# Altium project lab_1_pankov_usb_rs232.PrjPcb
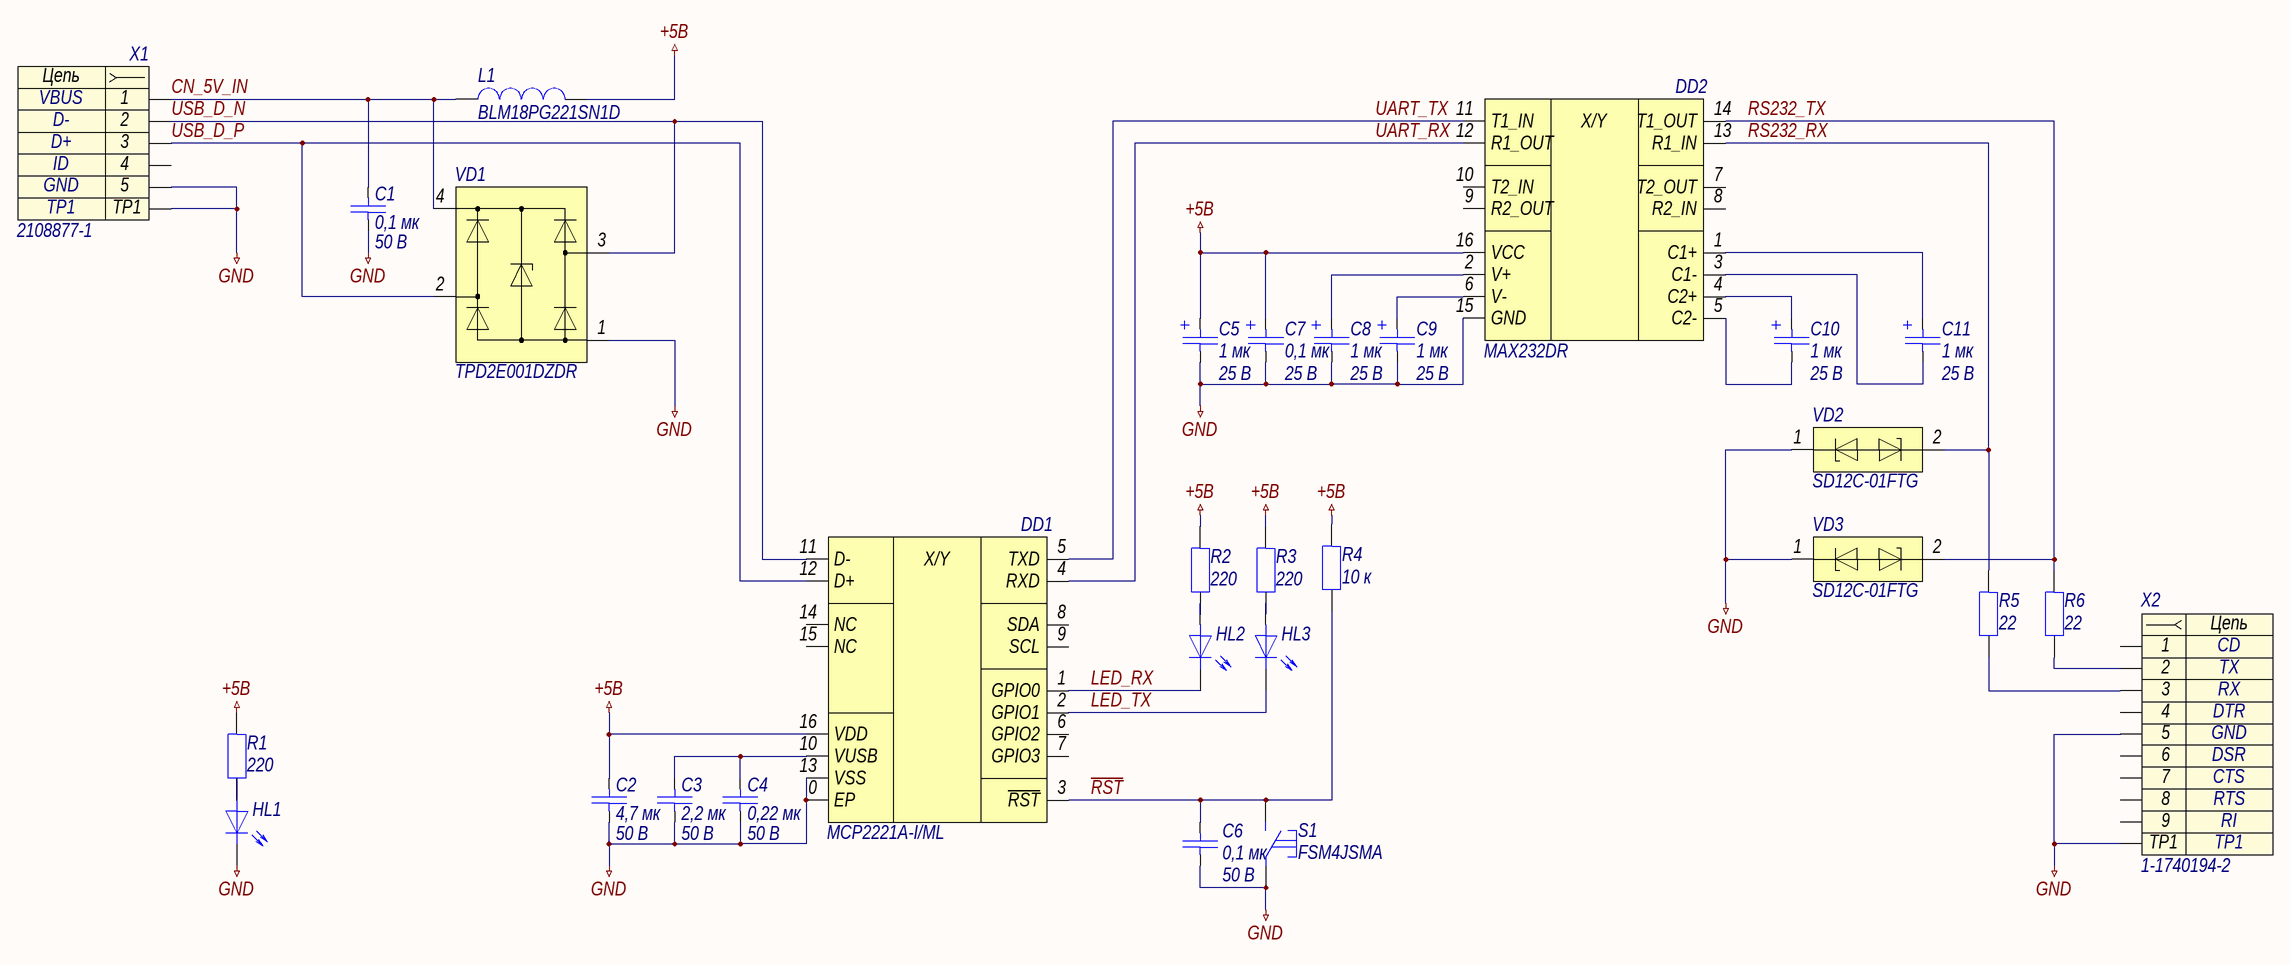
[diagram p0: lab_1_pankov_usb_rs232.SchDoc]
title_line_2: USB-RS232; title_line_1: Преобразователь; title: Лабораторная работа №1 — Преобразователь интерфейсов; sheets_total: 2; project: Преобразователь USB-RS232; pcb_dec_number: СПБПУ.3331506.019; document_type: Схема электрическая принципиальная; document_code: Ý3; developer: Паньков; designation: СПБПУ.3331506.019; check: Капустин
2 sheets, 29 parts. Net scope: global (net labels, ports and power ports of the same name join across sheets).
Board file: lab_1_pankov_usb_rs232.PcbDoc
Sheets:
  lab_1_pankov_usb_rs232.SchDoc
  usb_rs232_preferences.SchDoc

## Sheet lab_1_pankov_usb_rs232.SchDoc: Лабораторная работа №1 — Преобразователь интерфейсов
size 594 x 420 mm; CheckedBy: Капустин; DrawnBy: Паньков; DocumentNumber: СПБПУ.3331506.019Ý3; SheetNumber: 1; SheetTotal: 2; DocumentCode: Ý3; ImagePath: СПБПУ.3331506.019

### Parts
C1  0,1 мк  Напряжение: 50 В  [C0603]
C2  4,7 мк  Напряжение: 50 В  [C0603]
C3  2,2 мк  Напряжение: 50 В  [C0603]
C4  0,22 мк  Напряжение: 50 В  [C0603]
C5  1 мк  Напряжение: 25 В  [C1206POLAR]
C6  0,1 мк  Напряжение: 50 В  [C0603]
C7  0,1 мк  Напряжение: 25 В  [C1206POLAR]
C8  1 мк  Напряжение: 25 В  [C1206POLAR]
C9  1 мк  Напряжение: 25 В  [C1206POLAR]
C10  1 мк  Напряжение: 25 В  [C1206POLAR]
C11  1 мк  Напряжение: 25 В  [C1206POLAR]
DD1  MCP2221A-I/ML  [QFN-16-4X4]
DD2  MAX232DR  [SOIC-16]
HL1  TLMS1000-GS08  [HL0603]  (value not drawn)
HL2  TLMS1000-GS08  [HL0603]  (value not drawn)
HL3  TLMS1000-GS08  [HL0603]  (value not drawn)
L1  BLM18PG221SN1D  [BLM-2-0603]
R1  220  [R0603]
R2  220  [R0603]
R3  220  [R0603]
R4  10 к  [R0603]
R5  22  [R0603]
R6  22  [R0603]
S1  FSM4JSMA  [FSM4JSMA]
VD1  TPD2E001DZDR  [SOT143-4]
VD2  SD12C-01FTG  [SOD323]
VD3  SD12C-01FTG  [SOD323]
X1  2108877-1  [2108877-1]
X2  1-1740194-2  [1-1740194-2]

### Nets
+5В: C2.1 C5.1 C7.1 DD1.16(VDD) DD2.16(VCC) L1.2 R1.1 R2.1 R3.1 R4.1
GND: C1.2 C2.2 C3.2 C4.2 C5.2 C6.2 C7.2 C8.2 C9.2 DD1.0(EP) DD1.13(VSS) DD2.15(GND) HL1.1 S1.1 VD1.1(VCC) VD2.1 VD3.1 X1.5 X1.TP1 X2.5 X2.TP1
CN_5V_IN: C1.1 L1.1 VD1.4(GND) X1.1
LED_RX: DD1.1(GPIO0) HL2.1
LED_TX: DD1.2(GPIO1) HL3.1
~{RST}: C6.1 DD1.3(~{RST}) R4.2 S1.2
RS232_RX: DD2.13(R1_IN) R5.1 VD2.2
RS232_TX: DD2.14(T1_OUT) R6.1 VD3.2
UART_RX: DD1.4(RXD) DD2.12(R1_OUT)
UART_TX: DD1.5(TXD) DD2.11(T1_IN)
USB_D_N: DD1.11(D-) VD1.3(IO1) X1.2
USB_D_P: DD1.12(D+) VD1.2(NC) X1.3
NetC3_1: C3.1 C4.1 DD1.10(VUSB)
NetC8_1: C8.1 DD2.2(V+)
NetC9_1: C9.1 DD2.6(V-)
NetC10_1: C10.1 DD2.4(C2+)
NetC10_2: C10.2 DD2.5(C2-)
NetC11_1: C11.1 DD2.1(C1+)
NetC11_2: C11.2 DD2.3(C1-)
NetHL1_2: HL1.2 R1.2
NetHL2_2: HL2.2 R2.2
NetHL3_2: HL3.2 R3.2
NetR5_2: R5.2 X2.3
NetR6_2: R6.2 X2.2

Not connected (* = marked no-connect by the designer): DD1 6(GPIO2) 7(GPIO3) 8(SDA) 9(SCL) 14(NC) 15(NC); DD2 7(T2_OUT) 8(R2_IN) 9(R2_OUT) 10(T2_IN); X1 4; X2 1 4 6 7 8 9

### Notes on the sheet
- Перв. примен.
- Справ. №
- Подп. и дата
- Инв. № дубл.
- Нормоконтроль:
- Взам. инв. №
- Изм.
- Лист
- № докум.
- Подп.
- Дата
- Лит.
- Масса
- Масштаб
- Т.контр.
- Пров.
- Разраб.
- Листов
- Разработал:
- Инв. № подл.
- Н.контр.
- Утв.
- Копировал
- Формат
- А2
- (in symbol dd0005) X/Y
- (in symbol dd0007) X/Y
- (in symbol x0001) Цепь
- (in symbol x0002) Цепь

### Library data of the parts
C1 C6 = c0018: =Описание; ID: c0018; Фамилия: Ларионов; Описание: Конденсатор чип 0603 0,1 мкФ 50 В ±5 %; Наименование: CC0603JRX7R9BB104; Производитель: YAGEO Corp.; Отклонение: ±5 %; Рабочие температуры: от -55 °С до +125 °С; Корпус: 0603; Номинал: 0,1 мк; Номинальное напряжение: 50 В; HelpURL: https://www.yageo.com/upload/media/product/products/datasheet/mlcc/UPY-GPHC_X7R_6.3V-to-50V_20.pdf
C2 = c0029: =Описание; ID: c0029; Фамилия: Ларионов; Описание: Конденсатор чип 0603 4,7 мкФ 25 В ±10 %; Наименование: CC0603KRX5R8BB475; Производитель: YAGEO Corp.; Отклонение: ±10 %; Номинальное напряжение: 25 В; Рабочие температуры: от -55 °С до +85 °С; Корпус: 0603; Номинал: 4,7 мк; HelpURL: https://www.yageo.com/upload/media/product/productsearch/datasheet/mlcc/UPY-GPHC_X5R_4V-to-50V_26.pdf
C3 = c0026: =Описание; ID: c0026; Фамилия: Самарин; Описание: Конденсатор чип 0603 2,2 мкФ 50 В ±10 %; Наименование: CC0603KRX5R9BB225; Производитель: YAGEO Corp.; Отклонение: ±10 %; Рабочие температуры: от -55 °С до +85 °С; Корпус: 0603; Номинал: 2,2 мк; Номинальное напряжение: 50 В; HelpURL: https://www.yageo.com/upload/media/product/productsearch/datasheet/mlcc/UPY-GPHC_X5R_4V-to-50V_26.pdf
C4 = c0021: =Описание; ID: c0021; Фамилия: Самарин; Описание: Конденсатор чип 0603 0,22 мкФ 50 В ±5 %; Наименование: CC0603JRX7R9BB224; Производитель: YAGEO Corp.; Отклонение: ±5 %; Рабочие температуры: от -55 °С до +125 °С; Корпус: 0603; Номинал: 0,22 мк; Номинальное напряжение: 50 В; HelpURL: https://www.yageo.com/upload/media/product/products/datasheet/mlcc/UPY-GPHC_X7R_6.3V-to-50V_20.pdf
C5 C8-C11 = c0040: =Описание; ID: c0040; Фамилия: Ларионов; Описание: Конденсатор чип 1206 1 мкФ 25 В ±10 % полярный; Наименование: 293D105X9025A2TE3; Производитель: Vishay Intertechnology, Inc.; Отклонение: ±10 %; Рабочие температуры: от -55 °С до +125 °С; Корпус: 1206; Номинал: 1 мк; Номинальное напряжение: 25 В; HelpURL: https://www.vishay.com/capacitors/list/product-40002/
C7 = c0039: =Описание; ID: c0039; Фамилия: Ларионов; Описание: Конденсатор чип 1206 0,1 мкФ 50 В ±10 % полярный; Наименование: 293D104X9050A2TE3; Производитель: Vishay Intertechnology, Inc.; Отклонение: ±10 %; Номинальное напряжение: 50 В; Рабочие температуры: от -55 °С до +125 °С; Корпус: 1206; Номинал: 0,1 мк; HelpURL: https://www.vishay.com/capacitors/list/product-40002/
DD1 = dd0005: =Описание; ID: dd0005; Фамилия: Паньков; Описание: Преобразователь USB-I2C/UART; Производитель: Microchip Technology Inc.; Корпус: QFN-16 (4 x 4); Наименование: MCP2221A-I/ML; HelpURL: https://www.microchip.com/wwwproducts/en/MCP2221A
DD2 = dd0007: =Описание; ID: dd0007; Фамилия: Паньков; Описание: Приемопередатчик RS-232; Производитель: Texas Instruments; Наименование: MAX232DR; Корпус: SOIC-16; HelpURL: https://www.ti.com/product/MAX232?dcmp=dsproject&hqs=pf
HL1-HL3 = hl0001: =Описание; ID: hl0001; Фамилия: Ларионов; Описание: Светодиод чип 0603 красный; Производитель: Vishay Intertechnology, Inc.; Цвет: Red; Номинальная сила света: 4 мкд; Номинальная длина волны: 628 нм; Номинальный прямой ток: 15 мА; Номинальное падение напряжения: 1,8 В; Рассеиваемая мощность: 40 мВт; Рабочие температуры: от -40 °С до +100 °С; Корпус: 0603; Наименование: TLMS1000-GS08; HelpURL: https://www.vishay.com/leds/list/product-83172/
L1 = l0002: =Описание; ID: l0002; Фамилия: Самарин; Описание: Ферритовая бусина 220 Ом ±25 %; Производитель: Murata Manufacturing Co., Ltd.; Сопротивление, 100 МГц: 220 Ом; Отклонение, 100 Мгц: ±25 %; Сопротивление при постоянном токе: 0,1 Ом; Рабочие температуры: от -55 °С до +125 °С; Корпус: 0603; Наименование: BLM18PG221SN1D; HelpURL: https://www.murata.com/en-global/products/productdetail?partno=BLM18PG221SN1%23
R1-R3 = r0007: =Описание; ID: r0007; Фамилия: Ларионов; Описание: Резистор чип 0603 220 Ом ±1 % 0,1 Вт; Наименование: RC0603FR-07220RL; Производитель: Yageo; Отклонение: ±1 %; Номинальное напряжение: 75 В; Рабочие температуры: от -55 °С до +155 °С; Номинальный ток: 1 А; Корпус: 0603; Номинал: 220; HelpURL: https://www.yageo.com/upload/media/product/productsearch/datasheet/rchip/PYu-RC_Group_51_RoHS_L_11.pdf
R4 = r0012: =Описание; ID: r0012; Фамилия: Самарин; Описание: Резистор чип 0603 10 кОм ±1 % 0,1 Вт; Наименование: RC0603FR-0710KL; Производитель: Yageo; Отклонение: ±1 %; Номинальное напряжение: 75 В; Рабочие температуры: от -55 °С до +155 °С; Номинальный ток: 1 А; Корпус: 0603; Номинал: 10 к; HelpURL: https://www.yageo.com/upload/media/product/productsearch/datasheet/rchip/PYu-RC_Group_51_RoHS_L_11.pdf
R5 R6 = r0003: =Описание; ID: r0003; Фамилия: Ларионов; Описание: Резистор чип 0603 22 Ом ±1 % 0,1 Вт; Наименование: RC0603FR-0722RL; Производитель: Yageo; Отклонение: ±1 %; Номинальное напряжение: 75 В; Рабочие температуры: от -55 °С до +155 °С; Номинальный ток: 1 А; Корпус: 0603; Номинал: 22; HelpURL: https://www.yageo.com/upload/media/product/productsearch/datasheet/rchip/PYu-RC_Group_51_RoHS_L_11.pdf
S1 = sw0002: =Описание; ID: sw0002; Фамилия: Паньков; Описание: Нажимная кнопка; Производитель: TE Connectivity; Ток нагрузки: 50 мА @ 24 В; Сопротивление контакта: 100 мОм; Количество контактов: 4; Рабочие температуры: от –40 °С до +85 °С; Промывка: Разрешена; Корпус: 6,00 x 6,00 x 4,98; Наименование: FSM4JSMA; HelpURL: https://www.te.com/usa-en/product-4-1437565-1.html
VD1 = vd0007: ID: vd0007; Фамилия: Паньков; Описание: Диодная сборка для подавления помех, 5 В; Производитель: Texas Instruments; Корпус: SOP-4; Наименование: TPD2E001DZDR; HelpURL: https://www.ti.com/product/TPD2E001
VD2 VD3 = vd0002: =Описание; ID: vd0002; Фамилия: Ларионов; Описание: Двунаправленная диодная сборка для подавления помех, 12 В; Производитель: Littelfuse, Inc.; Наименование: SD12C-01FTG; Корпус: SOD323; HelpURL: https://www.littelfuse.com/products/tvs-diode-arrays/general-purpose-esd-protection/sdc/sd12c_01ftg.aspx
X1 = x0001: =Описание; Contact_1: VBUS; Contact_2: D-; Contact_3: D+; Contact_4: ID; Contact_5: GND; ID: x0001; Фамилия: Ларионов; Описание: Micro USB Type B IP68 гнездо; Производитель: TE Connectivity; Наименование: 2108877-1; HelpURL: https://www.te.com/global-en/product-2108877-1.html
X2 = x0002: =Описание; Contact_1: CD; Contact_2: TX; Contact_3: RX; Contact_4: DTR; Contact_5: GND; Contact_6: DSR; Contact_7: CTS; Contact_8: RTS; Contact_9: RI; ID: x0002; Фамилия: Ларионов; Описание: D-Sub 9 pin 2,74 мм гнездо; Производитель: TE Connectivity; Наименование: 1-1740194-2; HelpURL: https://www.te.com/global-en/product-1-1740194-2.html

## Sheet usb_rs232_preferences.SchDoc: Лабораторная работа №1 — Преобразователь интерфейсов
size 209 x 297 mm; CheckedBy: Капустин; DrawnBy: Паньков; DocumentNumber: СПБПУ.3331506.019Ý3; SheetNumber: 2; SheetTotal: 2; DocumentCode: Ý3; ImagePath: СПБПУ.3331506.019
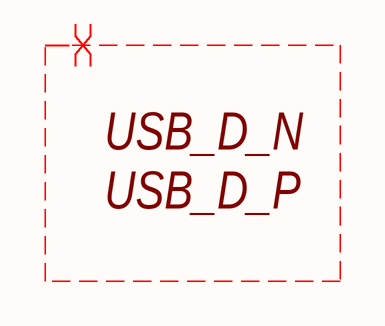
[diagram p1: usb_rs232_preferences.SchDoc]

### Layout directives
differential pair: USB_D_N, USB_D_P

### Notes on the sheet
- Labels drawn without touching a wire or pin: USB_D_N, USB_D_P
- Подп. и дата
- Инв. № дубл.
- Взам. инв. №
- Инв. № подл.
- Лист
- Изм.
- № докум.
- Подп.
- Дата
- Копировал
- Формат
- А4